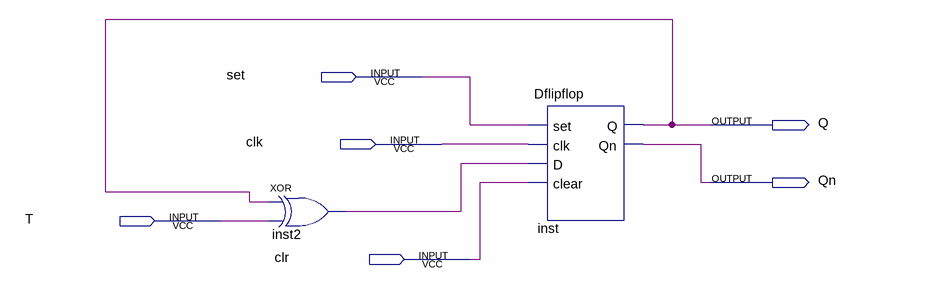
[diagram p0: schematic sheet]
// Quartus schematic Tflipflop.bdf as structural Verilog: 2 symbols, 6 pins
module Tflipflop (
  input  set,
  input  clk,
  input  T,
  input  clr,
  output Q,
  output Qn
);

  wire inst2_out;

  xor inst2 (inst2_out, Q, T);
  Dflipflop inst (.set(set), .clk(clk), .D(inst2_out), .clear(clr), .Q(Q), .Qn(Qn));
endmodule
